# Altium project TMPTBRD_V3.PrjPcb (part 2 of 2)
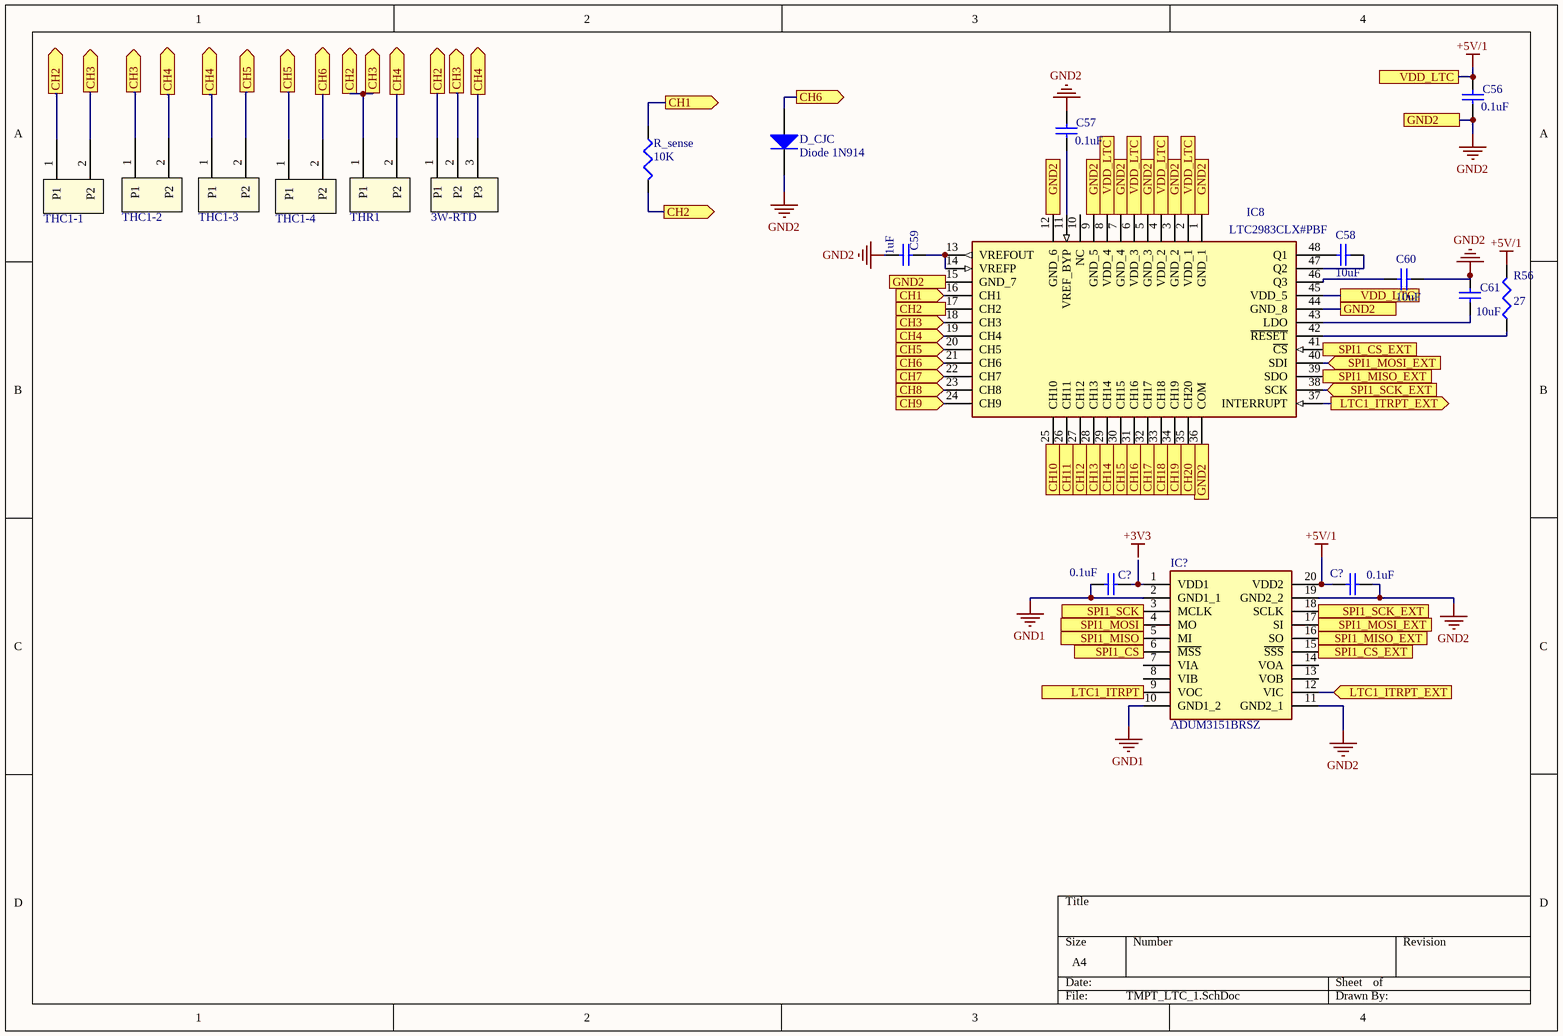
[diagram p10: TMPT_LTC_1.SchDoc]

## Nets that join several sheets
+3V3: Supply (C10.2 C11.2 IC2.3 R4.2), MCU (12 pins), MCU_compnts (17 pins), Led RGB (R13.2 R14.2 R15.2), ISO_CAN2 (C37.2 IC3.1), EEPROM&RTC (15 pins), uSD (7 pins), USART (6 pins)
+5V: Supply (5 pins), Relays_channels (10 pins)
+5V/1: Supply (C5.2 C6.2 IC1.3 R2.2), ISO_CAN2 (C9.2 C36.2 IC3.11 IC3.16), USART (P1.2 R42.2), TMPT_LTC_1 (9 pins)
+24V: Supply (7 pins), Relays_channels (5 pins)
+24V_EXT: Supply (F1.1 R1.2), ISO_CAN2 (J1.2)
GND1: Supply (11 pins), MCU (11 pins), MCU_compnts (33 pins), Led RGB (6 pins), ISO_CAN2 (C37.1 IC3.2 IC3.7 IC3.8), EEPROM&RTC (8 pins), uSD (7 pins), USART (6 pins), TMPT_LTC_1 (C?#1.2 IC?.2 IC?.10)
GND2: Supply (13 pins), ISO_CAN2 (11 pins), USART (P2.1 R44.1), Relays_channels (15 pins), TMPT_LTC_1 (18 pins)
Net3W-RTD_1: Relays_channels (K2.1 K3.1 P4.1 P5.1), TMPT_LTC_1 (9 pins)
Net3W-RTD_3: Relays_channels (K4.1 P6.1), TMPT_LTC_1 (5 pins)
NetC14_2: MCU (MCU.32 MCU.33), MCU_compnts (C14.2 C15.2 FB1.2)
NetC16_2: MCU (MCU.71), MCU_compnts (C16.2)
NetC17_2: MCU (MCU.106), MCU_compnts (C17.2)
NetC34_1: MCU (MCU.25), MCU_compnts (C34.1 J2.10 NRST.2 R9.1)
NetC43_2: MCU (MCU.6), MCU_compnts (D3.2 Q1.2), EEPROM&RTC (C43.2 IC4.15)
NetIC3_3: MCU (MCU.136), ISO_CAN2 (IC3.3)
NetIC3_5: MCU (MCU.135), ISO_CAN2 (IC3.5)
NetIC4_1: MCU (MCU.74), EEPROM&RTC (IC4.1 R26.1)
NetIC4_2: MCU (MCU.76), EEPROM&RTC (IC4.2 R25.1)
NetIC4_3: MCU (MCU.75), EEPROM&RTC (IC4.3)
NetIC4_4: MCU (MCU.73), EEPROM&RTC (IC4.4 R24.1)
NetIC6_11: MCU (MCU.69), USART (IC6.11)
NetIC6_12: MCU (MCU.70), USART (IC6.12)
NetIC7_11: MCU (MCU.36), USART (IC7.11)
NetIC7_12: MCU (MCU.37), USART (IC7.12)
NetIC8_16: Relays_channels (K1.1 P3.1), TMPT_LTC_1 (IC8.16 R_sense.1)
NetIC8_20: Relays_channels (K5.1 P7.1), TMPT_LTC_1 (IC8.20 THC1-3.2 THC1-4.1)
NetIC?_3: MCU (MCU.41), TMPT_LTC_1 (IC?.3)
NetIC?_4: MCU (MCU.43), TMPT_LTC_1 (IC?.4)
NetIC?_5: MCU (MCU.42), TMPT_LTC_1 (IC?.5)
NetIC?_6: MCU (MCU.40), TMPT_LTC_1 (IC?.6)
NetIC?_9: MCU (MCU.47), TMPT_LTC_1 (IC?.9)
NetJ2_2: MCU (MCU.105), MCU_compnts (J2.2)
NetJ2_4: MCU (MCU.109), MCU_compnts (J2.4)
NetJ2_6: MCU (MCU.133), MCU_compnts (J2.6)
NetJ2_8: MCU (MCU.110), MCU_compnts (J2.8)
NetJ3_2: MCU (MCU.114), uSD (J3.2 R39.1)
NetJ3_3: MCU (MCU.113), uSD (J3.3 R38.1)
NetJ3_5: MCU (MCU.111), uSD (J3.5)
NetJ3_7: MCU (MCU.112), uSD (J3.7 R37.1)
NetJ3_9: MCU (MCU.77), uSD (J3.9 R36.1)
NetMCU_1: MCU (MCU.1), EEPROM&RTC (U2.6)
NetMCU_3: MCU (MCU.3), EEPROM&RTC (R29.1 U2.1)
NetMCU_4: MCU (MCU.4), EEPROM&RTC (R30.1 U2.2)
NetMCU_5: MCU (MCU.5), EEPROM&RTC (R28.1 U2.5)
NetMCU_23: MCU (MCU.23), MCU_compnts (R8.1)
NetMCU_24: MCU (MCU.24), MCU_compnts (R6.1)
NetMCU_44: MCU (MCU.44), Led RGB (R20.2)
NetMCU_45: MCU (MCU.45), Led RGB (R16.2)
NetMCU_46: MCU (MCU.46), Led RGB (R18.2)
NetMCU_68: MCU (MCU.68), EEPROM&RTC (Q5.2 R34.2)
NetMCU_87: MCU (MCU.87), Relays_channels (R46.2)
NetMCU_88: MCU (MCU.88), Relays_channels (R47.2)
NetMCU_89: MCU (MCU.89), Relays_channels (R48.2)
NetMCU_90: MCU (MCU.90), Relays_channels (R52.2)
NetMCU_91: MCU (MCU.91), Relays_channels (R53.2)
NetMCU_134: MCU (MCU.134), MCU_compnts (R12.2)
NetMCU_138: MCU (MCU.138), MCU_compnts (R5.2)